# Altium schematic sheet DI.SchDoc
size A4 portrait; SheetNumber: 9; SheetTotal: 14
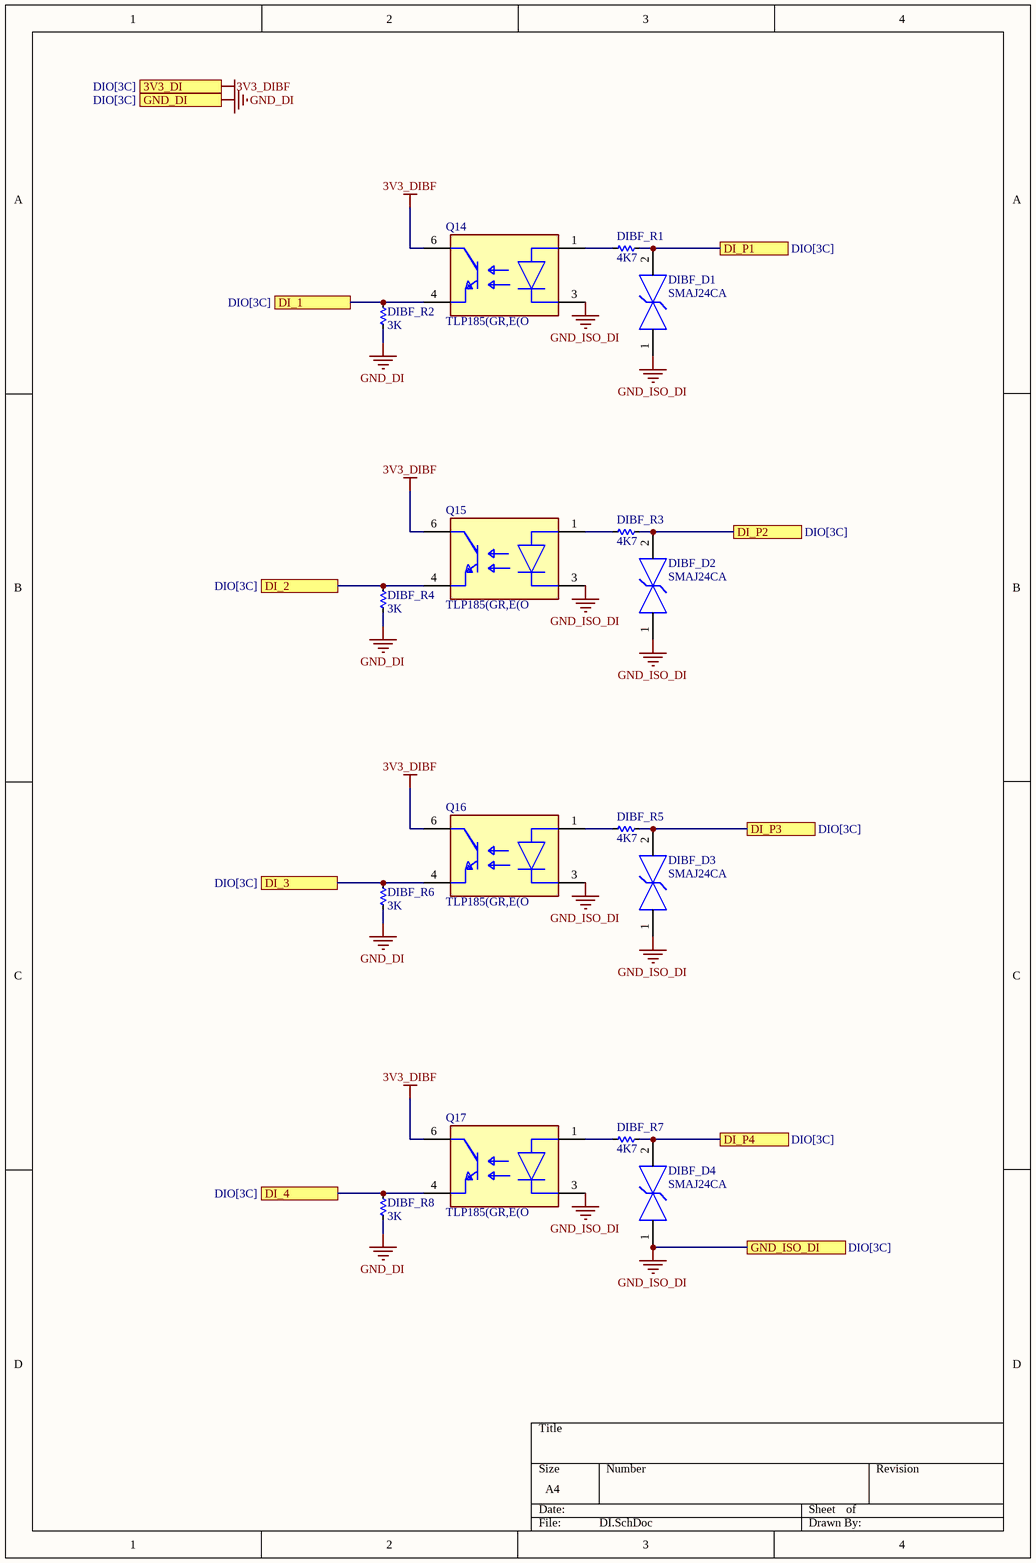
[diagram p0: DI.SchDoc]

## Parts
DIBF_D1  SMAJ24CA  [FP-SMAJ-CA-MFG]
DIBF_D2  SMAJ24CA  [FP-SMAJ-CA-MFG]
DIBF_D3  SMAJ24CA  [FP-SMAJ-CA-MFG]
DIBF_D4  SMAJ24CA  [FP-SMAJ-CA-MFG]
DIBF_R1  4K7  [RES-SMD-0805]
DIBF_R2  3K  [RES-SMD-0805]
DIBF_R3  4K7  [RES-SMD-0805]
DIBF_R4  3K  [RES-SMD-0805]
DIBF_R5  4K7  [RES-SMD-0805]
DIBF_R6  3K  [RES-SMD-0805]
DIBF_R7  4K7  [RES-SMD-0805]
DIBF_R8  3K  [RES-SMD-0805]
Q14  TLP185(GR,E(O  [FP-11-4M1S-MFG]
Q15  TLP185(GR,E(O  [FP-11-4M1S-MFG]
Q16  TLP185(GR,E(O  [FP-11-4M1S-MFG]
Q17  TLP185(GR,E(O  [FP-11-4M1S-MFG]

## Ports
3V3_DI (see DIO[3C]), DI_1 (see DIO[3C]), DI_2 (see DIO[3C]), DI_3 (see DIO[3C]), DI_4 (see DIO[3C]), DI_P1 (see DIO[3C]), DI_P2 (see DIO[3C]), DI_P3 (see DIO[3C]), DI_P4 (see DIO[3C]), GND_DI (see DIO[3C]), GND_ISO_DI (see DIO[3C])

## Nets
3V3_DIBF: Q14.6(C) Q15.6(C) Q16.6(C) Q17.6(C) ; port 3V3_DI
GND_DI: DIBF_R2.2 DIBF_R4.2 DIBF_R6.2 DIBF_R8.2 ; port GND_DI
GND_ISO_DI: DIBF_D1.1 DIBF_D2.1 DIBF_D3.1 DIBF_D4.1 Q14.3(C) Q15.3(C) Q16.3(C) Q17.3(C) ; port GND_ISO_DI
DI_1: DIBF_R2.1 Q14.4(E) ; port DI_1
DI_2: DIBF_R4.1 Q15.4(E) ; port DI_2
DI_3: DIBF_R6.1 Q16.4(E) ; port DI_3
DI_4: DIBF_R8.1 Q17.4(E) ; port DI_4
DI_P1: DIBF_D1.2 DIBF_R1.1 ; port DI_P1
DI_P2: DIBF_D2.2 DIBF_R3.1 ; port DI_P2
DI_P3: DIBF_D3.2 DIBF_R5.1 ; port DI_P3
DI_P4: DIBF_D4.2 DIBF_R7.1 ; port DI_P4
NetDIBF_R1_2: DIBF_R1.2 Q14.1(A)
NetDIBF_R3_2: DIBF_R3.2 Q15.1(A)
NetDIBF_R5_2: DIBF_R5.2 Q16.1(A)
NetDIBF_R7_2: DIBF_R7.2 Q17.1(A)

## Library data of the parts
DIBF_D1-DIBF_D4 = CMP-2000-07087-2: TVS DIODE 24V 38.9V DO214AC; Manufacturer: Littelfuse; Peak Pulse Power: 400W; Direction: Bidirectional; Breakdown Voltage: 26.7V; Max Junction Temp: +150°C; Number Of Channels: 1; Peak Pulse Current: 10.3A; Digikey Description: TVS DIODE 24V 38.9V DO214AC; Temperature Range Low: -65°C; Temperature: -65°C to +150°C; Manufacturer Part Number: SMAJ24CA; Octopart: https://octopart.com/smaj24ca-littelfuse-350011; Height: 2.29mm; Clamping Voltage: 38.9V; Device Class L1: Circuit Protection; Automotive: No; Device Class L2: TVS Diodes; Package: SMAJ-CA; ComponentLink2URL: https://www.littelfuse.com/~/media/electronics/datasheets/tvs_diodes/littelfuse_tvs_diode_smaj_datasheet.pdf.pdf; RoHS: TRUE; Temperature Range High: +150°C; Category: Diode; Lead Free: Yes; Reverse Standoff Voltage: 24V; Device Class L3: unset; ComponentLink2Description: Datasheet; Mouser Description: In a Pack of 25, Littelfuse SMAJ24CA, Bi-Directional TVS Diode, 400W, 2-Pin DO-214AC
DIBF_R1-DIBF_R8 = Res-SMD: Res 0805 1%; Manufacturer: Generic Components; Class: Passive; Published: 08/06/2000; Publisher: Altium Hobart Technology Centre
Q14-Q17 = CMP-35887-000005-1: OPTOISO 3.75KV TRANS 6-SO 4 LEAD; Manufacturer: Toshiba; Emiiter Collector Voltage: 7V; Isolation Voltage: 3750Vrms; Collector Emitter Voltage: 80V; Max Junction Temp: +125°C; Turn On Delay Time: 9us; Standoff Height: 0.1mm; Power Dissipation: 200mW; Forward Current: 10mA; Min Current Transfer Ratio: 100%; Forward Voltage: 1.25V; Reverse Voltage: 5V; Max Current Transfer Ratio: 400%; Manufacturer Part Number: TLP185(GR,E(O; Device Class L1: Optoelectronics; ComponentLink2Description: Datasheet; Lead Free: Yes; Height: 2.2mm; Octopart: https://octopart.com/tlp185%28gr%2Ce%28o-toshiba-23809180; RoHS: TRUE; Temperature: -55°C to +110°C; Category: Trans; Temperature Range Low: -55°C; Automotive: No; Package: 11-4M1S; Device Class L2: Optocouplers; Footprint Url: https://toshiba.semicon-storage.com/eu/design-support/package/detail.4pin%20SO6.html; Digikey Description: OPTOISO 3.75KV TRANS 6-SO 4 LEAD; Ipc Land Pattern Name: SOIC254P700X220-4; Temperature Range High: +110°C; Turn Off Delay Time: 9us; ComponentLink2URL: https://toshiba.semicon-storage.com/info/docget.jsp?did=11791&prodName=TLP185; Device Class L3: unset